# EasyEDA Pro project RadioFox.eprj, board PCB4
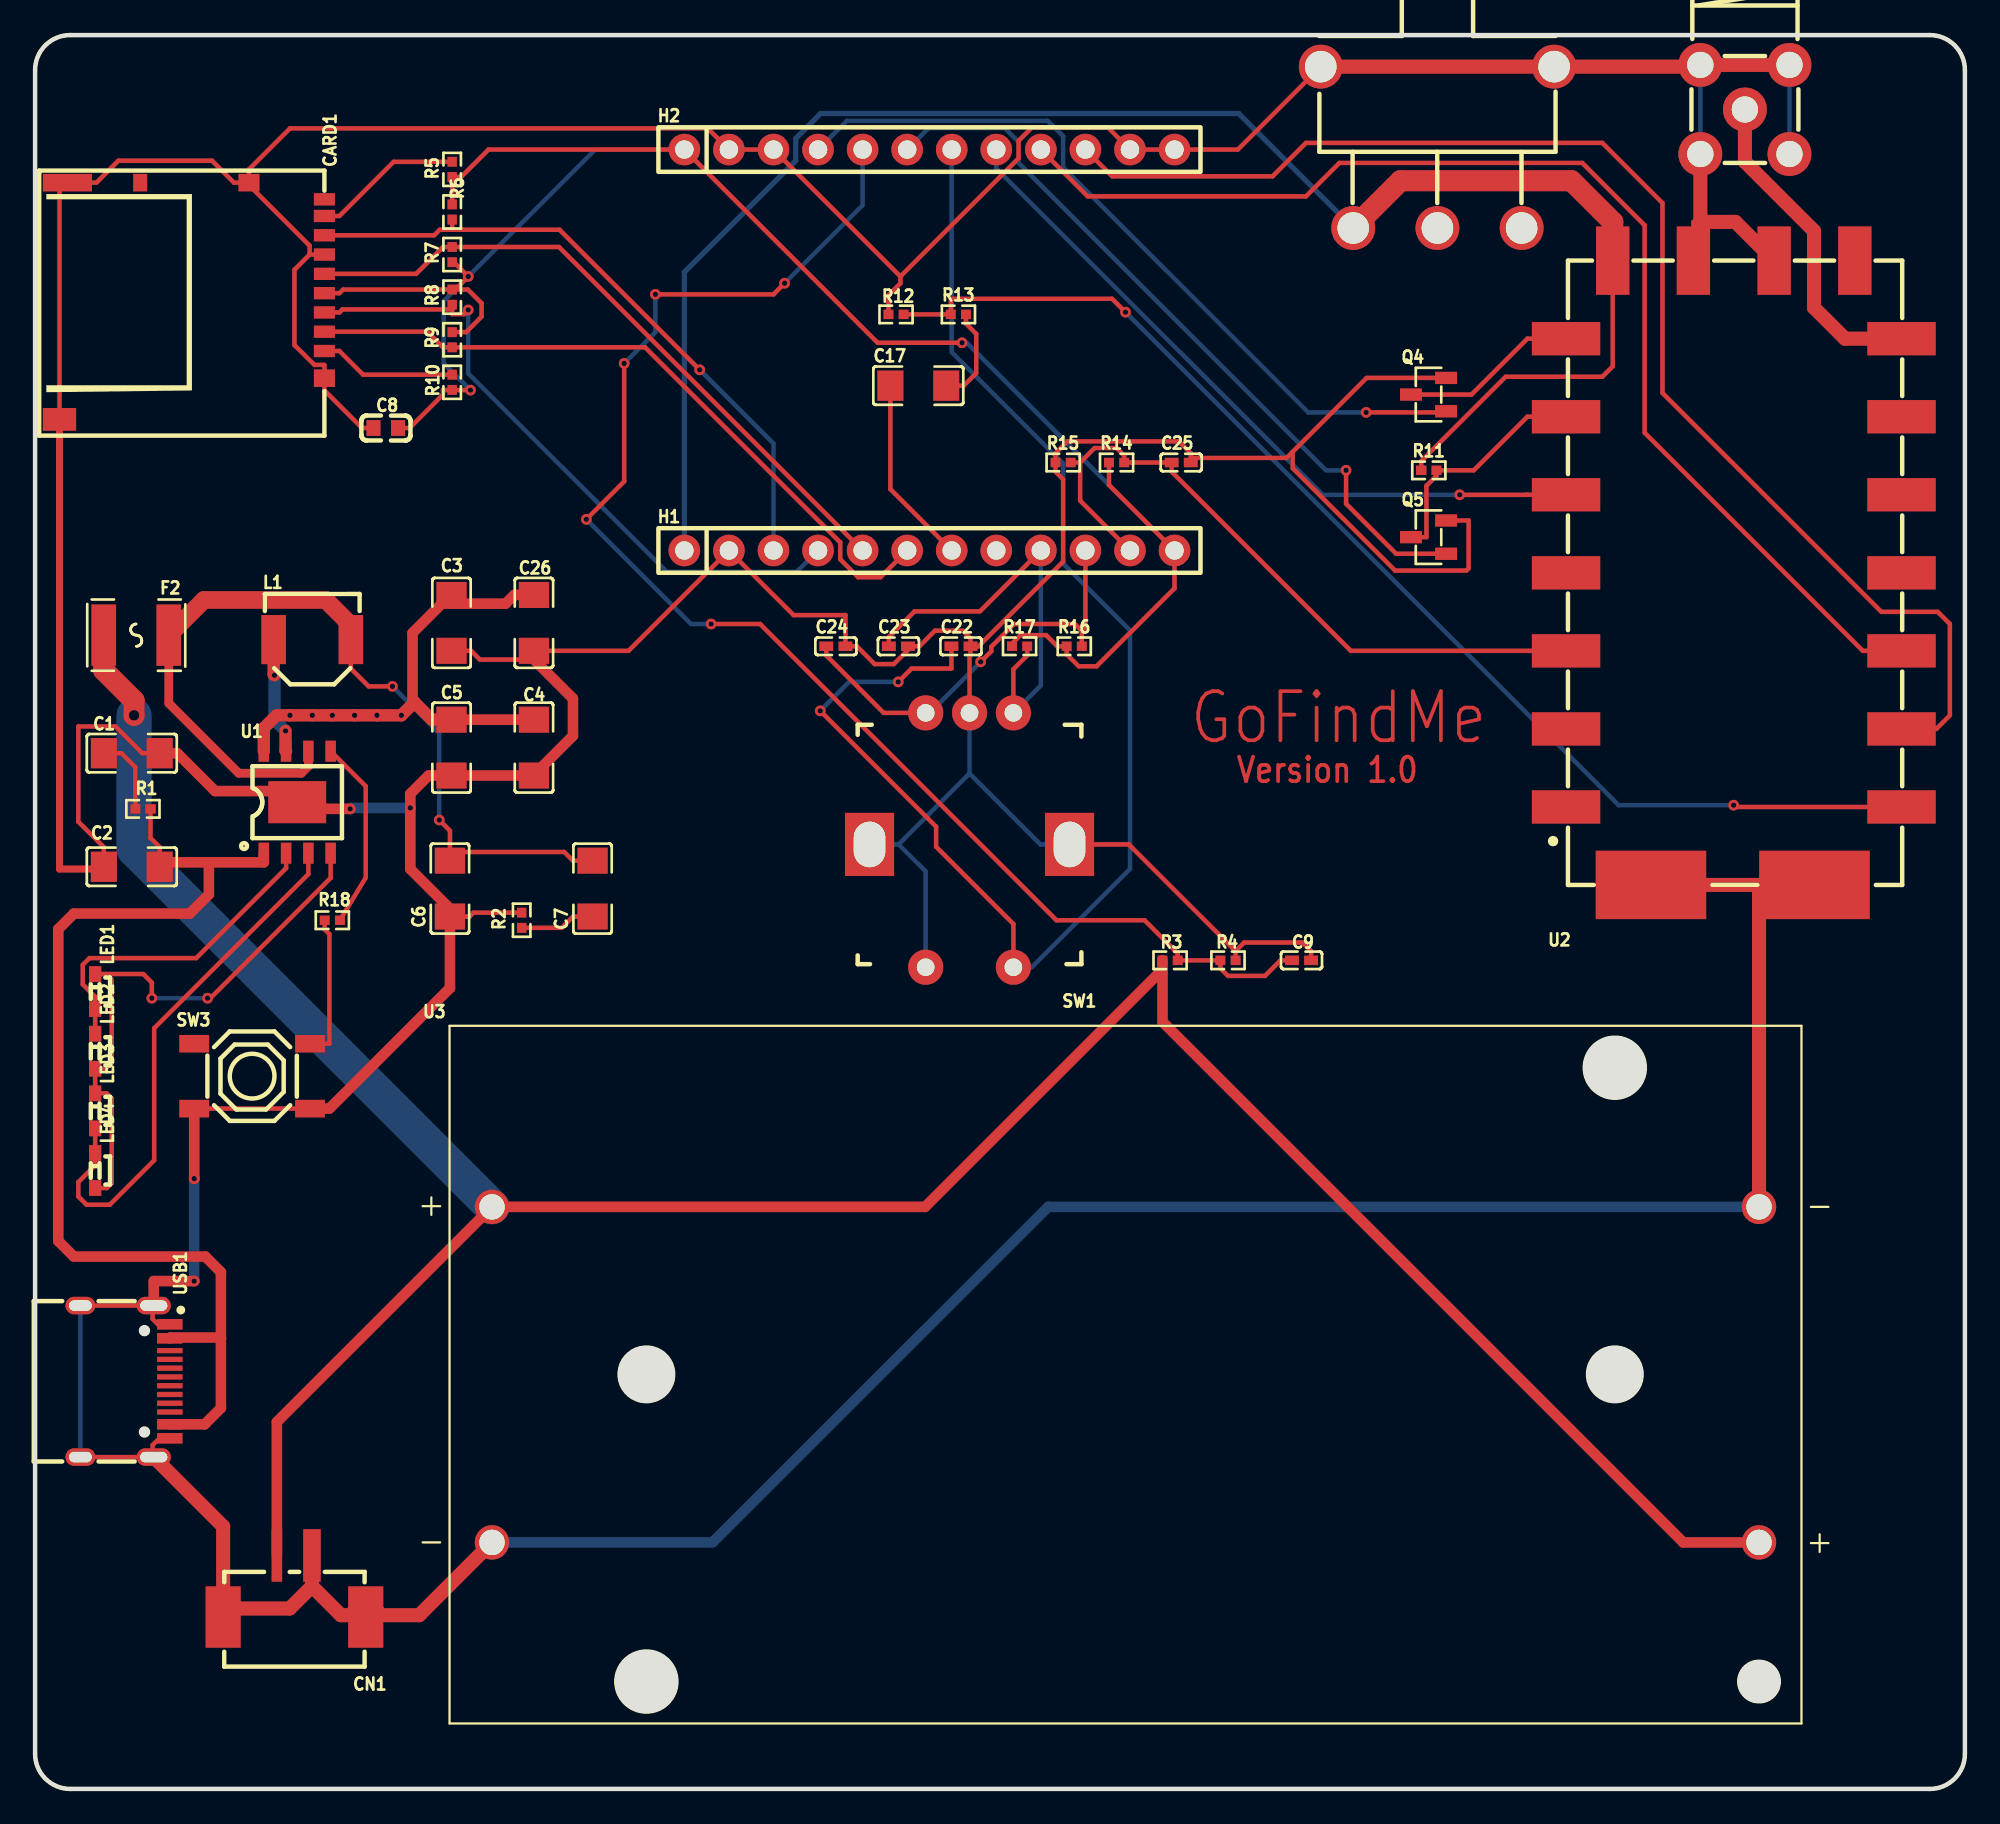
[diagram p10: board, top side]
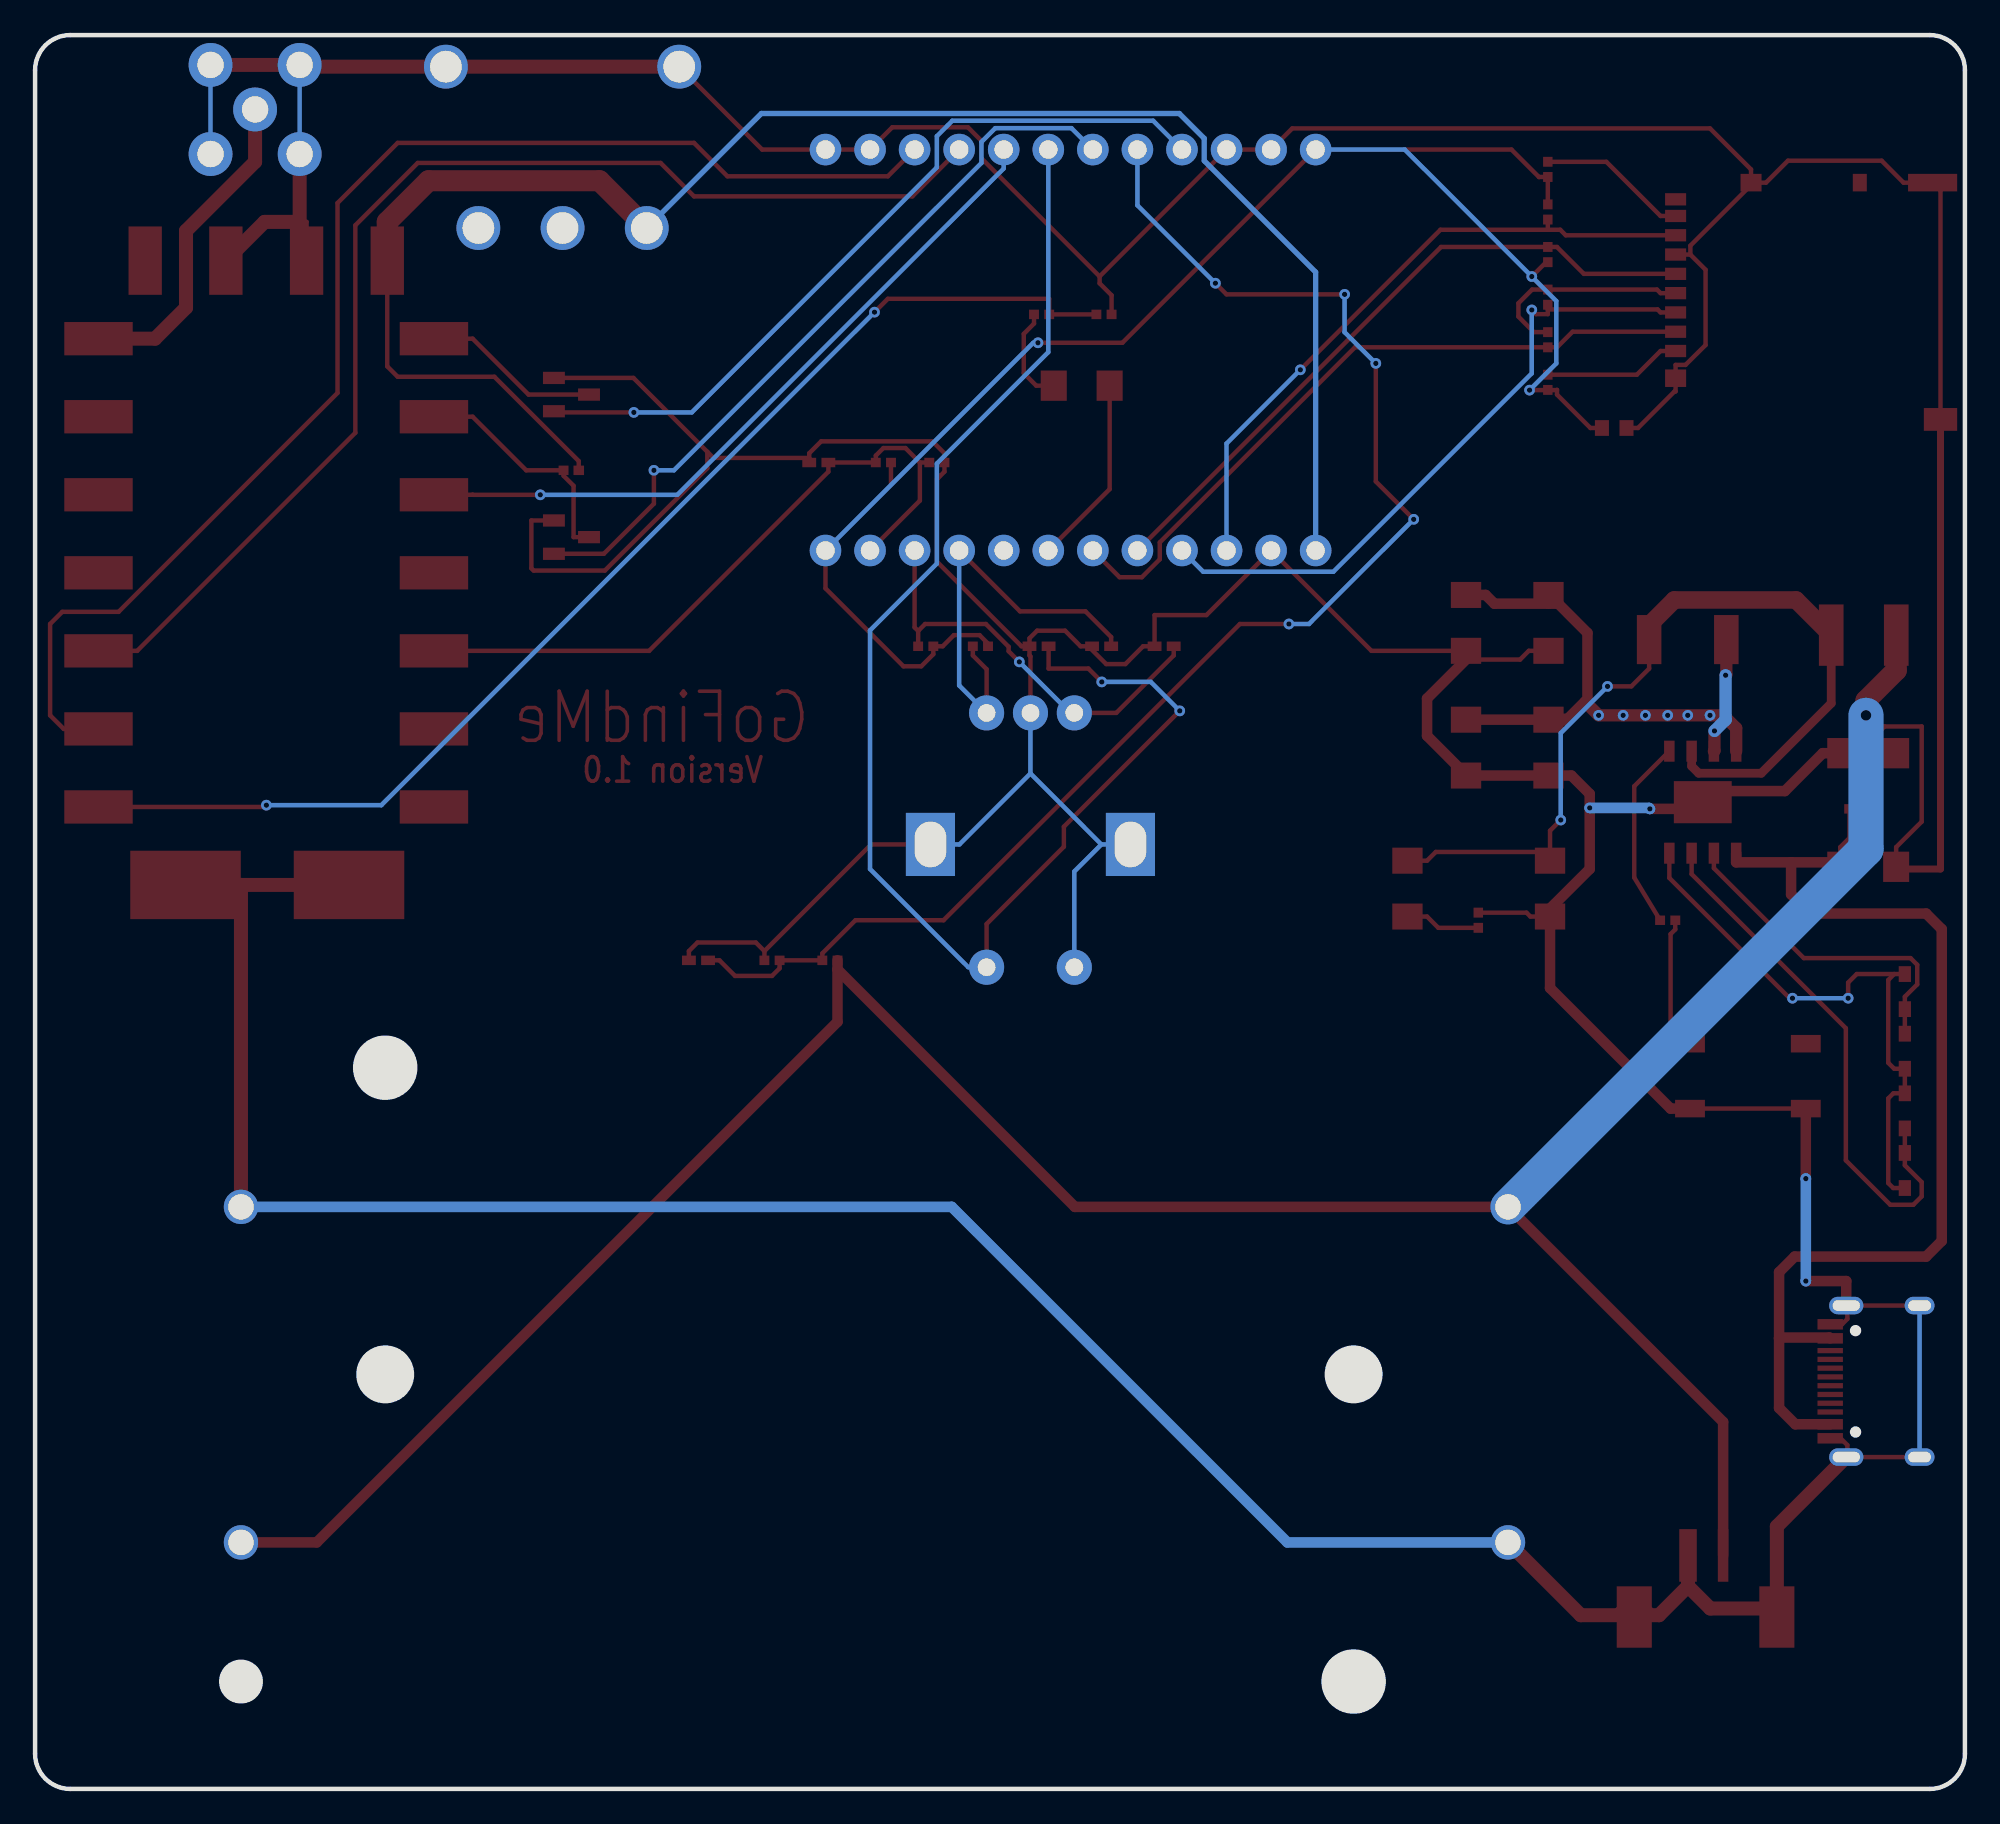
[diagram p11: board, bottom side, seen from below]

Outline 110 x 100 mm; copper layers: Top Layer, Bottom Layer. Coordinates in mm from the lower left corner of the outline.
Outline path: 0,98 0,2 arc(0.59,0.59) 2,0 108,0 arc(109.41,0.59) 110,2 110,98 arc(109.41,99.41) 108,100 2,100 arc(0.59,99.41) 0,98
Stack: Top Layer 0.035mm / Dielectric1 1.51mm FR4 er 4.5 / Bottom Layer 0.035mm

## Design rules (mm)
template: JLCPCB Capability(Two Layers Board)
spacing copperThickness1oz (default): track to track 0.102, other pairs 0.152 to 0.3
spacing copperThickness2oz: track to track 0.203, other pairs 0.152 to 0.3
track width copperThickness1oz (default): min 0.127, default 0.254, max 2.54
track width copperThickness2oz: min 0.203, default 0.254, max 2.54
differential pair differentialPair (default): width min 0.127, default 0.254, max 2.54; gap min 0.152, default 0.152
via viaSize (default): diameter min 0.5, default 0.61, max 10; hole min 0.3, default 0.305, max 6.3

## Placement (name value [footprint] x y rotation side)
C1  10uF  [C1206]  5.51 59.06 180 top
C2  10uF  [C1206]  5.51 52.58 0 top
C3  22uF  [C1206]  23.74 66.48 270 top
C4  22uF  [C1206]  28.44 59.37 270 top
C5  22uF  [C1206]  23.74 59.37 270 top
C6  10uF  [C1206]  23.65 51.33 90 top
C7  10uF  [C1206]  31.78 51.33 90 top
C8  100nF  [C0603]  19.99 77.6 180 top
C9  100nF  [C0402]  72.19 47.24 180 top
C17  10uF  [C1206]  50.34 80.01 0 top
C22  47nF  [C0402]  52.78 65.15 0 top
C23  47nF  [C0402]  49.21 65.15 0 top
C24  47nF  [C0402]  45.64 65.15 0 top
C25  10nF  [C0402]  65.33 75.63 0 top
C26  22uF  [C1206]  28.44 66.48 270 top
CARD1  DM3AT-SF-PEJM5  [SD-SMD_DM3AT-SF-PEJM5]  8.94 84.84 270 top
CN1  PH2.0-2P-LT  [conn-smd_ph2.0-1x2pw]  14.78 11.56 180 top
F2  BSMD1812-250-8V  [F1812]  5.77 65.79 180 top
H1  A2541HWV-12P  [HDR-TH_12P-P2.54-V-F]  50.98 70.61 0 top
H2  A2541HWV-12P  [HDR-TH_12P-P2.54-V-F]  50.98 93.47 0 top
L1  1uH  [IND-SMD_L5.4-W5.1_SPM5020]  15.8 65.53 0 top
LED1  MHS171WDT-C2  [LED-SMD_L2.0-W1.1-R-RD-SIDE_WHITE]  3.42 45.46 270 top
LED2  MHS171WDT-C2  [LED-SMD_L2.0-W1.1-R-RD-SIDE_WHITE]  3.42 42.06 270 top
LED3  MHS171WDT-C2  [LED-SMD_L2.0-W1.1-R-RD-SIDE_WHITE]  3.42 38.66 270 top
LED4  MHS171WDT-C2  [LED-SMD_L2.0-W1.1-R-RD-SIDE_WHITE]  3.42 35.26 270 top
Q4  2N7002_R1_00001  [SOT-23-3_L2.9-W1.3-P1.90-LS2.4-BR]  79.43 79.5 0 top
Q5  2N7002_R1_00001  [SOT-23-3_L2.9-W1.3-P1.90-LS2.4-BR]  79.43 71.37 0 top
R1  2Ω  [r0402]  6.15 55.88 0 top
R2  2Ω  [R0402]  27.74 49.53 90 top
R3  43kΩ  [R0402]  64.69 47.24 0 top
R4  100kΩ  [R0402]  68 47.24 0 top
R5  20kΩ  [R0402]  23.77 92.34 90 top
R6  20kΩ  [R0402]  23.77 89.91 270 top
R7  20kΩ  [R0402]  23.77 87.49 90 top
R8  20kΩ  [R0402]  23.77 85.06 270 top
R9  20kΩ  [R0402]  23.77 82.63 270 top
R10  20kΩ  [R0402]  23.77 80.2 90 top
R11  10K  [r0402#2]  79.44 75.18 0 top
R12  10kΩ  [R0402]  49.07 84.07 180 top
R13  47kΩ  [R0402]  52.63 84.07 0 top
R14  100kΩ  [R0402]  61.65 75.63 0 top
R15  100kΩ  [R0402]  58.6 75.63 0 top
R16  47kΩ  [R0402]  59.23 65.15 0 top
R17  47kΩ  [R0402]  56.12 65.15 0 top
R18  10kΩ  [R0402]  16.94 49.53 0 top
RF1  KH-SMA-P-8496  [SMA-TH_KH-SMA-P-8496]  97.46 95.76 0 top
SW1  PEC11R-4220F-S0012  [SW-TH_PEC11R-4220F-S0012]  53.26 54.1 180 top
SW3  TS-1187A-B-A-B  [SW-SMD_4P-L5.1-W5.1-P3.70-LS6.5-TL-2]  12.37 40.64 0 top
SW4  SS-12D11L5  [SW-TH_SS-12D11L5]  79.93 93.6 0 top
U1  IP5306  [ESOP-8_L4.9-W3.9-P1.27-LS6.0-BL-EP]  14.94 56.26 0 top
U2  SA818S-V  [WIRELM-SMD_G-NICERF_SA818S-X]  96.83 69.34 90 top
U3  -  [BAT_1049P]  62.15 23.62 0 top
USB1  YTC-TC16-473  [USB-SMD_YTC-TC16-473]  5.13 23.24 270 top

## Footprints (pads in the part's own frame, mm; a bottom-side part is the same pattern mirrored in y, then rotated)
BAT_1049P
  round 1.958 hole 1.45: 1(-36.11,9.565) 2(36.11,9.565) 3(-36.11,-9.565) 4(36.11,-9.565)
C0402
  rect 0.79x0.54 smd: 1(-0.545,0) 2(0.545,0)
C0603
  rect 0.8x0.9 smd: 1(-0.7,0) 2(0.7,0)
C1206
  rect 1.485x1.728 smd: 1(-1.593,0) 2(1.593,0)
conn-smd_ph2.0-1x2pw
  rect 1x3 smd: 1(-1,-1.756)
  rect 0.6x3 smd: 2(1,-1.756)
  rect 2x3.5 smd: 3(4.064,1.756) 4(-4.064,1.756)
ESOP-8_L4.9-W3.9-P1.27-LS6.0-BL-EP
  rect 0.6x1.2 smd: 1(-1.905,-2.909) 2(-0.635,-2.909) 3(0.635,-2.909) 4(1.905,-2.909) 5(1.905,2.909) 6(0.635,2.909) 7(-0.635,2.909) 8(-1.905,2.909)
  rect 3.3x2.4 smd: 9(0,0)
F1812
  rect 1.407x3.499 smd: 1(-1.853,0) 2(1.853,0)
HDR-TH_12P-P2.54-V-F
  round 1.8 hole 1.05: 1(-13.97,0) 2(-11.43,0) 3(-8.89,0) 4(-6.35,0) 5(-3.81,0) 6(-1.27,0) 7(1.27,0) 8(3.81,0) 9(6.35,0) 10(8.89,0) 11(11.43,0) 12(13.97,0)
IND-SMD_L5.4-W5.1_SPM5020
  rect 1.4x2.8 smd: 1(-2.2,0) 2(2.2,0)
LED-SMD_L2.0-W1.1-R-RD-SIDE_WHITE
  rect 0.9x0.7 smd: 1(1,0) 2(-1,0)
r0402
  rect 0.566x0.54 smd: 1(-0.433,0)
  rect 0.6x0.54 smd: 2(0.433,0)
r0402#2
  rect 0.6x0.54 smd: 1(-0.433,0)
  rect 0.566x0.54 smd: 2(0.433,0)
R0402
  rect 0.566x0.54 smd: 1(-0.433,0) 2(0.433,0)
SD-SMD_DM3AT-SF-PEJM5
  rect 0.7x1.2 smd: 1(2.85,7.55) 2(1.75,7.55) 3(0.65,7.55) 4(-0.45,7.55) 5(-1.55,7.55) 6(-2.65,7.55) 7(-3.75,7.55) 8(-4.85,7.55) 9(-5.8,7.55)
  rect 1x1.2 smd: 10(-6.75,3.25) 14(4.4,7.55)
  rect 1x0.8 smd: 11(-6.75,-2.95)
  rect 1x2.8 smd: 12(-6.75,-7.1)
  rect 1.3x1.9 smd: 13(6.75,-7.55)
SMA-TH_KH-SMA-P-8496
  round 2.5 hole 1.5: 1(-2.54,2.54) 2(2.54,2.54) 3(2.54,-2.54) 4(-2.54,-2.54) 5(0,0)
SOT-23-3_L2.9-W1.3-P1.90-LS2.4-BR
  rect 1.25x0.7 smd: 1(1,-0.95) 2(1,0.95) 3(-1,0)
SW-SMD_4P-L5.1-W5.1-P3.70-LS6.5-TL-2
  rect 1.7x1 smd: 1(-3.3,1.85) 2(3.3,1.85) 3(-3.3,-1.85) 4(3.3,-1.85)
SW-TH_PEC11R-4220F-S0012
  round 2 hole 1.005x1: 1(-2.499,7.25) 2(2.499,7.25) A(-2.499,-7.25) B(2.499,-7.25) C(0,-7.25)
  rect 2.8x3.6 hole 1.8x2.6: 3(-5.7,0.25) 3(5.7,0.25)
SW-TH_SS-12D11L5
  round 2.5 hole 1.8: 1(-4.8,-4.6) 2(0,-4.6) 3(4.8,-4.6) 4(-6.65,4.6) 5(6.65,4.6)
USB-SMD_YTC-TC16-473
  oval 1x1.95 hole 0.6x1.55: 1(-4.32,1.633) 2(4.32,1.633)
  oval 1x1.7 hole 0.6x1.3: 3(-4.32,-2.547) 4(4.32,-2.547)
  rect 0.6x1.45 smd: A1B12(-3.25,2.547) A4B9(-2.45,2.547) B1A12(3.25,2.547) B4A9(2.45,2.547)
  rect 0.3x1.45 smd: A5(-1.25,2.547) A6(-0.25,2.547) A7(0.25,2.547) A8(1.25,2.547) B5(1.75,2.547) B6(0.75,2.547) B7(-0.75,2.547) B8(-1.75,2.547)
WIRELM-SMD_G-NICERF_SA818S-X
  rect 1.9x3.9 smd: 1(-13.352,9.56) 2(-8.902,9.56) 3(-4.452,9.56) 4(-0.003,9.56) 5(4.447,9.56) 6(8.898,9.56) 7(13.348,9.56) 12(13.348,-9.56) 13(8.898,-9.56) 14(4.447,-9.56) 15(-0.003,-9.56) 16(-4.452,-9.56) 17(-8.902,-9.56) 18(-13.352,-9.56)
  rect 3.9x1.9 smd: 8(17.797,6.9) 9(17.797,2.3) 10(17.797,-2.3) 11(17.797,-6.9)
  rect 3.9x6.3 smd: 19(-17.797,-4.6) 20(-17.797,4.72)

## Nets
As in the schematic, except:
GND: C1.1 C2.1 C3.2 C4.2 C5.2 C6.1 C8.2 C9.1 C22.2 C23.2 C24.2 C25.2 C26.2 CARD1.6 CARD1.10 CARD1.12 CARD1.13 CARD1.14 CN1.1 CN1.3 CN1.4 H1.2 H2.2 H2.3 H2.11 H2.12 Q4.2 Q5.2 R2.2 R4.2 R12.2 R15.1 RF1.1 RF1.2 RF1.3 RF1.4 SW1.2 SW1.3 SW1.C SW3.3 SW3.4 SW4.4 SW4.5 U1.9 U2.9 U2.10 U2.19 U2.20 U3.2 U3.3 USB1.1 USB1.2 USB1.3 USB1.4 USB1.A1B12 USB1.B1A12
ANT: RF1.5 U2.12

Pads without a net: CARD1 9 11; H1 8; SW3 1; SW4 3; U2 1 2 4 11 13 14 15; USB1 A5 A6 A7 A8 B5 B6 B7 B8

## Via types
v1: diameter 0.61, hole 0.305, Top Layer to Bottom Layer, 34 vias
v2: diameter 1.2, hole 0.6, Top Layer to Bottom Layer, 1 via

## Routing (per net, layer and track width the routed paths; a pad name or vN(x,y) marks a point on that pad's centre or on a via; arc(x,y) is an arc through that point)
3V3: length 116.7
  Top Layer w0.254: C8.1 21.35,77.6 23.25,79.5 23.25,79.77 23.26,79.76 v1(24.82,79.76) ; 23.77,83.06 24.57,83.06 25.45,83.95 25.45,84.71 24.67,85.49 23.95,85.49 ; 16.49,85.29 17.35,85.29 17.55,85.49 23.95,85.49 ; 23.77,91.91 24.28,91.91 24.28,91.91 25.84,93.47 H2.1 48.02,82.46 v1(52.84,82.46) ; R14.1 61.21,74.35 H1.12 64.95,68.45 60.5,64.01 59.49,64.01 58.8,64.7 58.8,65.15 58.27,65.15 57.63,65.79 56.17,65.79 55.68,65.3 R17.1 ; 23.95,85.49 v1(24.69,86.23) 23.87,87.05 23.77,87.05 ; R6.1 R5.1
  Bottom Layer w0.254: v1(52.84,82.46) 53.1,82.46 H1.12 ; H2.1 31.93,93.47 v1(24.69,86.23) 23.29,84.84 23.29,81.28 v1(24.82,79.76)
5V: length 100
  Top Layer w0.254: 79.01,75.18 79.01,75.71 83.82,80.52 89.33,80.52 89.93,81.11 U2.8
  Top Layer w1.2: SW4.1 77.83,91.69 87.57,91.69 89.93,89.35 U2.8
  Bottom Layer w0.3: SW4.1 68.6,95.53 44.78,95.53 43.36,94.11 43.36,92.83 37.01,86.48 H1.1
5VREG: length 30.1
  Top Layer w0.254: C3.1 23.74,67.58
  Top Layer w0.6: 21.62,61.96 21.51,62.07 21.51,65.91 23.18,67.58 23.74,67.58 26.82,67.58 27.32,68.08 C26.1 ; C5.1 C4.1
  Top Layer w0.7: C5.1 22.62,60.97 21.62,61.96 v1(20.88,61.21) v1(19.48,61.21) v1(18.21,61.21) v1(16.94,61.21) v1(15.8,61.21) v1(14.53,61.21) 13.77,61.21 13.04,60.49 U1.8
GND: length 591.3
  Top Layer w0.254: C22.2 53.77,65.15 58.6,69.98 58.6,74.67 58.17,75.11 R15.1 58.17,76.15 58.85,76.83 65.19,76.83 65.88,76.15 65.88,75.89 ; C22.2 53.32,64.63 53.26,64.57 53.26,61.35 ; C22.2 53.32,65.6 52.88,66.04 51.29,66.04 50.41,65.15 49.96,65.15 48.95,64.14 47.85,64.14 46.84,65.15 C24.2 46.19,66.93 43.23,66.93 H1.2 33.83,64.89 C26.2 28.44,64.39 25.35,64.39 24.86,64.89 C3.2 ; C8.2 18.64,77.6 16.55,79.68 16.49,79.68 16.49,81.19 15.93,81.19 14.78,82.33 14.78,86.62 15.65,87.48 ; 71.68,76.24 75.9,80.45 Q4.2 ; 71.68,76.24 71.68,75.3 77.52,69.47 81.58,69.47 81.71,69.6 81.71,72.32 Q5.2 ; 71.68,76.24 71.34,75.89 65.88,75.89 ; CN1.4 18.85,10.81 ; 72.73,47.24 72.73,47.77 72.24,48.26 68.92,48.26 68.43,47.77 ; 15.65,87.48 15.65,87.99 12.19,91.45 12.19,91.58 ; 15.65,87.48 16.49,87.48 ; 68.43,47.77 62.34,53.85 SW1.3 ; 68.43,47.77 68.43,47.24 ; U2.9 94.53,89.35 94.92,89.35 ; 3.92,52.58 3.92,53.7 2.46,55.15 2.46,60.58 4.58,60.58 6.11,59.06 C1.1 ; SW4.4 68.56,93.47 H2.12 H2.11 61.14,94.74 56.83,94.74 56.06,93.97 56.06,92.97 49.32,86.24 ; 12.19,91.58 11.34,91.58 10.09,92.84 4.75,92.84 3.5,91.58 1.84,91.58 1.39,91.14 1.39,78.09 ; 12.19,91.58 12.19,92.34 14.53,94.68 38.34,94.68 H2.2 H2.3 49.32,86.24 ; 101.42,51.54 98.27,51.54 ; C25.2 65.88,75.89 ; C6.1 24.77,49.74 24.99,49.96 27.74,49.96 ; USB1.3 USB1.1 6.7,27.5 6.7,26.8 7.01,26.49 USB1.A1B12 ; 49.32,86.24 49.32,85.85 48.64,85.17 R12.2 ; 2.58,18.92 6.76,18.92 6.7,18.99 6.7,19.6 7.09,19.99 7.68,19.99 ; C4.2 28.44,57.82 ; CN1.3 10.72,10.29 ; 9.07,38.79 15.67,38.79
  Top Layer w0.4: C2.1 3.79,52.45 1.39,52.45 CARD1.13
  Top Layer w0.6: SW3.3 9.07,34.8 v1(9.07,34.8) ; 28.44,64.39 30.66,62.17 30.66,60.05 28.44,57.82 28.39,57.78 C5.2 22.43,57.78 21.39,56.74 v1(21.39,55.94) 21.39,52.45 23.65,50.19 C6.1 23.65,45.66 16.78,38.79 15.67,38.79 ; 15.67,38.79 SW3.4 ; v1(9.07,28.96) 6.76,28.96 USB1.1 ; v1(17.96,55.88) 15.32,55.88 14.94,56.26 ; 14.94,56.9 10.26,56.9 8.1,59.06 7.11,59.06
  Top Layer w0.8: U2.20 98.27,51.54 98.27,33.19 ; U2.10 96.92,89.35 94.92,89.35 RF1.4 ; 6.76,18.92 10.72,14.97 10.72,10.29 14.51,10.29 15.78,11.56 ; 15.78,13.31 15.78,11.56 ; 15.78,11.56 17.43,9.91 17.95,9.91 18.85,10.81 19.75,9.91 21.9,9.91 26.05,14.06 ; RF1.2 RF1.1 94.82,98.2 SW4.5 SW4.4
  Bottom Layer w0.254: 2.58,27.56 2.58,18.92 ; SW1.3 57.31,53.85 53.26,57.9 ; 53.26,61.35 53.26,57.9 ; 53.26,57.9 49.22,53.85 ; 49.22,53.85 SW1.3 ; 49.22,53.85 50.76,52.31 SW1.2 ; RF1.4 RF1.1 ; RF1.3 RF1.2
  Bottom Layer w0.6: v1(9.07,34.8) v1(9.07,28.96) ; 26.04,14.06 38.62,14.06 57.75,33.19 U3.2 ; v1(17.96,55.88) 18.01,55.94 v1(21.39,55.94)
VBAT+: length 160.3
  Top Layer w0.6: 64.26,46.72 64.26,43.74 93.94,14.06 98.27,14.06 ; 64.26,46.72 R3.1 ; 64.26,46.72 50.73,33.19 26.05,33.19 13.78,20.92 CN1.2
  Top Layer w1.2: F2.2 3.91,63.78 5.64,62.05 v2(5.64,61.21)
  Bottom Layer w2: 26.05,33.19 5.64,53.59 v2(5.64,61.21)
AF_OUT: length 40.1
  Top Layer w0.254: 59.57,75.63 59.57,73.45 H1.11 ; 59.57,75.63 R15.2 ; 59.57,75.63 60.39,76.45 61.65,76.45 62.08,76.02 R14.2 64.78,75.63 64.78,75.11 75,64.89 87.26,64.89
ANT: length 18.7
  Top Layer w0.8: RF1.5 97.46,92.77 101.4,88.84 101.4,84.45 103.16,82.69 U2.12
BATLEVELSENSE: length 83.4
  Top Layer w0.254: v1(33.58,81.28) 33.58,74.55 v1(31.42,72.39) ; v1(38.53,66.42) 41.33,66.42 58.22,49.53 63.24,49.53 65.13,47.64 R3.2 67.56,47.24 67.56,46.79 68,46.36 70.1,46.36 70.99,47.24 71.64,47.24 ; v1(42.72,85.85) 42.09,85.22 v1(35.36,85.22)
  Bottom Layer w0.254: v1(31.42,72.39) 37.39,66.42 v1(38.53,66.42) ; v1(42.72,85.85) 47.17,90.3 H2.5 ; v1(35.36,85.22) 35.36,83.06 v1(33.58,81.28)
H/L: length 10.2
  Top Layer w0.254: 87.26,82.69 85.06,82.69 81.87,79.5 Q4.3
H/L_SIG: length 44.4
  Top Layer w0.254: Q4.1 80.36,78.49 v1(75.87,78.49)
  Bottom Layer w0.254: v1(75.87,78.49) 72.57,78.49 58.6,92.46 58.6,94.23 57.72,95.11 46.27,95.11 H2.4
LED1: length 18.9
  Top Layer w0.254: 3.42,43.06 LED1.1 3.42,45.17 2.72,45.87 2.72,46.99 3.1,47.37 9.18,47.37 14.31,52.5 14.31,53.35
LED2: length 31
  Top Layer w0.254: 3.42,37.66 3.42,35.56 2.46,34.6 2.46,33.78 2.94,33.31 4.26,33.31 6.79,35.84 6.79,43.37 15.58,52.16 U1.3
LED3: length 33.4
  Top Layer w0.254: 4.03,46.46 6.17,46.46 6.66,45.97 v1(6.66,45.08) ; 4.03,46.46 4.37,46.12 4.37,41.4 4.03,41.06 LED2.1 LED3.2 4.08,39.66 4.37,39.37 4.37,34.54 4.09,34.26 LED4.1 ; 4.03,46.46 LED1.2 ; 16.85,53.35 16.85,51.94 9.99,45.08 v1(9.83,45.08)
  Bottom Layer w0.254: v1(9.83,45.08) v1(6.66,45.08)
MIC-INPUT: length 10.8
  Top Layer w0.254: C17.1 48.75,74.11 H1.7
POWER: length 63.1
  Top Layer w0.254: C2.2 7.1,53.7 6.58,54.22 6.58,55.88
  Top Layer w0.6: 9.91,52.83 9.91,51 8.81,49.91 2.21,49.91 1.32,49.02 1.32,31.24 2.21,30.35 9.7,30.35 10.59,29.46 10.59,25.69 ; 9.91,52.83 13.04,52.83 U1.1 ; 9.91,52.83 7.41,52.83 7.1,53.14 ; 10.59,25.69 10.54,25.74 7.73,25.74 USB1.A4B9 ; 10.59,25.69 10.59,21.72 9.67,20.79 USB1.B4A9
PTT: length 41.3
  Top Layer w0.254: v1(81.2,73.79) 85.06,73.79 85.06,73.79 87.26,73.79
  Bottom Layer w0.254: H2.8 54.79,92.39 73.39,73.79 v1(81.2,73.79)
RADIO_SLEEP: length 13.6
  Top Layer w0.254: 87.26,78.24 85.06,78.24 82,75.18 R11.2 79.88,74.87 79.31,74.3 79.31,71.37 Q5.3
RX_RF: length 69.4
  Top Layer w0.254: U2.16 104.18,64.89 91.75,77.33 91.75,89.15 88.19,92.71 74.35,92.71 72.44,90.81 60,90.81 H2.9
SLEEP_CONTROL: length 43.1
  Top Layer w0.254: v1(74.73,75.18) 74.73,73.28 77.58,70.42 Q5.1
  Bottom Layer w0.254: v1(74.73,75.18) 73.58,75.18 56.06,92.71 56.06,93.91 55.27,94.69 50.93,94.69 H2.6
SW1: length 83.1
  Top Layer w0.254: v1(44.75,61.47) 51.36,54.86 51.36,53.72 55.76,49.32 SW1.1 ; v1(49.2,63.12) 49.96,63.88 52.23,63.88 C22.1
  Bottom Layer w0.254: v1(49.2,63.12) 46.41,63.12 v1(44.75,61.47) ; H2.7 52.25,81.92 58.6,75.57 58.6,69.87 62.41,66.06 62.41,52.45 56.81,46.85 55.76,46.85
SWA: length 25.3
  Top Layer w0.254: 55.76,61.35 55.76,63.84 56.55,64.63 56.55,65.15 ; C23.1 48.66,65.68 50.13,67.14 53.86,67.14 H1.9
  Bottom Layer w0.254: H1.9 57.33,62.92 55.76,61.35
SWB: length 24.4
  Top Layer w0.254: 59.66,66.03 59.87,66.23 H1.10 ; 59.66,66.03 59.27,66.42 55.8,66.42 54.51,65.12 54.51,64.87 v1(53.9,64.26) ; 59.66,66.03 59.66,65.15 ; 50.76,61.35 48.37,61.35 45.1,64.63 C24.1
  Bottom Layer w0.254: 50.76,61.35 50.99,61.35 v1(53.9,64.26)
TX_RF: length 76.7
  Top Layer w0.254: H2.10 61.39,91.95 70.54,91.95 72.44,93.85 89.33,93.85 92.76,90.42 92.76,79.6 105.24,67.11 108.45,67.11 109.14,66.42 109.14,61.21 108.37,60.44 U2.17
$2N118: length 37.5
  Top Layer w0.254: R6.2 23.77,88.94 23.73,88.9 ; 23.73,88.9 29.89,88.9 v1(37.88,80.91) ; 23.73,88.9 23.07,88.9 22.75,88.58 16.49,88.58
  Bottom Layer w0.254: H1.3 42.09,76.71 v1(37.88,80.91)
$2N119: length 37.6
  Top Layer w0.254: 16.49,84.19 17.35,84.19 17.52,84.36 23.77,84.36 ; 23.77,84.36 23.77,84.09 24.45,84.09 v1(24.69,84.33) ; 23.77,84.36 R8.2
  Bottom Layer w0.254: H1.4 43.41,69.4 36,69.4 24.69,80.71 v1(24.69,84.33)
$2N120: length 38.5
  Top Layer w0.254: H1.5 29.86,87.92 23.25,87.92 21.72,86.39 16.49,86.39
$2N121: length 8.6
  Top Layer w0.254: R5.2 20.44,92.77 17.35,89.69 16.49,89.69
$2N122: length 40.2
  Top Layer w0.254: H1.6 48.18,69.09 46.91,69.09 45.89,70.11 45.89,71.07 34.77,82.2 R9.2 23.25,82.2 22.36,83.09 16.49,83.09
$2N123: length 7.8
  Top Layer w0.254: 23.77,80.64 18.7,80.64 17.35,81.99 16.49,81.99
$2N921: length 4.5
  Top Layer w0.254: 3.92,59.06 4.92,59.06 5.72,58.26 R1.1
$2N930: length 69.8
  Top Layer w0.254: v1(96.82,56.09) 96.92,55.99 106.39,55.99 ; R12.1 52.2,84.07 52.2,84.96 61.39,84.96 v1(62.15,84.2)
  Bottom Layer w0.254: v1(62.15,84.2) 90.26,56.09 v1(96.82,56.09)
$2N934: length 5.6
  Top Layer w0.254: 53.06,84.07 53.06,83.55 53.65,82.96 53.65,80.72 52.93,80.01 C17.2
$2N9497: length 4.3
  Top Layer w0.254: 27.74,49.1 30.02,49.1 30.66,49.74 C7.1
$2N10454: length 6.7
  Top Layer w0.7: v1(13.64,63.5) 13.6,63.54 L1.1 ; v1(14.28,60.33) 14.28,59.2 U1.7
  Bottom Layer w0.7: v1(13.64,63.5) 13.64,60.96 v1(14.28,60.33)
$2N10458: length 51.2
  Top Layer w0.254: C6.2 23.65,53.42 ; 23.65,53.42 30.16,53.42 30.66,52.93 C7.2 ; 23.65,53.42 23.65,54.64 v1(23.04,55.25) ; L1.2 18,63.88 19.01,62.86 v1(20.37,62.86)
  Top Layer w0.5: U1.6 15.58,58.32 15.17,57.91 11.61,57.91 7.62,61.9 F2.1
  Top Layer w1: F2.1 9.63,67.79 16.57,67.79 18,66.36 L1.2
  Bottom Layer w0.254: v1(20.37,62.86) 23.04,60.2 v1(23.04,55.25)
$2N33469: length 8.3
  Top Layer w0.254: 15.67,42.49 16.78,42.49 16.78,48.74 16.51,49.01 R18.1
$2N33473: length 10.9
  Top Layer w0.254: 16.85,59.17 18.85,57.17 18.85,51.96 17.37,49.53

## Copper pours and planes (outline as drawn; the poured copper is in the pictures)
5VREG on Bottom Layer: -0.08,99.95 109.91,99.95 109.91,-0.38 -0.08,-0.38
GND on Top Layer: -3.76,99.95 116,99.95 116,-4.44 -3.76,-4.44

## Text on the board
Top Layer: Version 1.0 | GoFindMe
